# EAGLE design sound sensor (EAGLE 5.10)
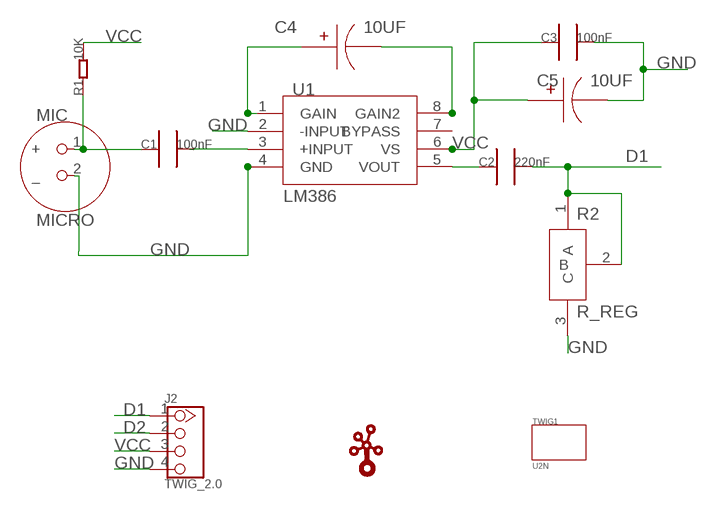
[diagram p0: schematic, sheet 1]

## Parts
C1  100nF  C0603  [0603]
C2  220nF  C0603  [0603]
C3  100nF  C0603  [0603]
C4  10UF  C_TAN1206  [C_TAN1206]
C5  10UF  C_TAN1206  [C_TAN1206]
J2  TWIG_2.0  [2.0_1X4]
MIC  MICRO  [MICRO]
R1  10K  R0603  [0603]
R2  R_REG  [R_REG]
TWIG1  U2N  [U2N]
U1  LM386  [SO08]
U$1  TWIGLOGOTWIGLOGO_SMALL  [TWIGLOGO_SMALL]

## Nets
D1: C2.2 J2.1 R2.1(A) R2.2(B)
D2: J2.2
GND: C3.2 C5.2 J2.4 MIC.2(_) R2.3(C) U1.2(-INPUT) U1.4(GND)
N$2: C4.2 U1.8(GAIN2)
N$3: C1.1 MIC.1(+) R1.1
N$4: C1.2 U1.3(+INPUT)
N$5: C4.1 U1.1(GAIN)
N$6: C2.1 U1.5(VOUT)
VCC: C3.1 C5.1 J2.3 R1.2 U1.6(VS)
Unconnected: U1.7(BYPASS)

## Library data of the parts
C1-C3 = CPT_SMD:C0603; C0603: 100N
C4 C5 = seeedleo:C_TAN1206
J2 = CONNECTER:TWIG_2.0
MIC = seeedleo:MICRO
R1 = CPT_SMD:R0603
R2 = seeedleo:R_REG
TWIG1 = twig_template1:U2N
U1 = seeedleo:LM386
U$1 = seeedleo:TWIGLOGO

## Board
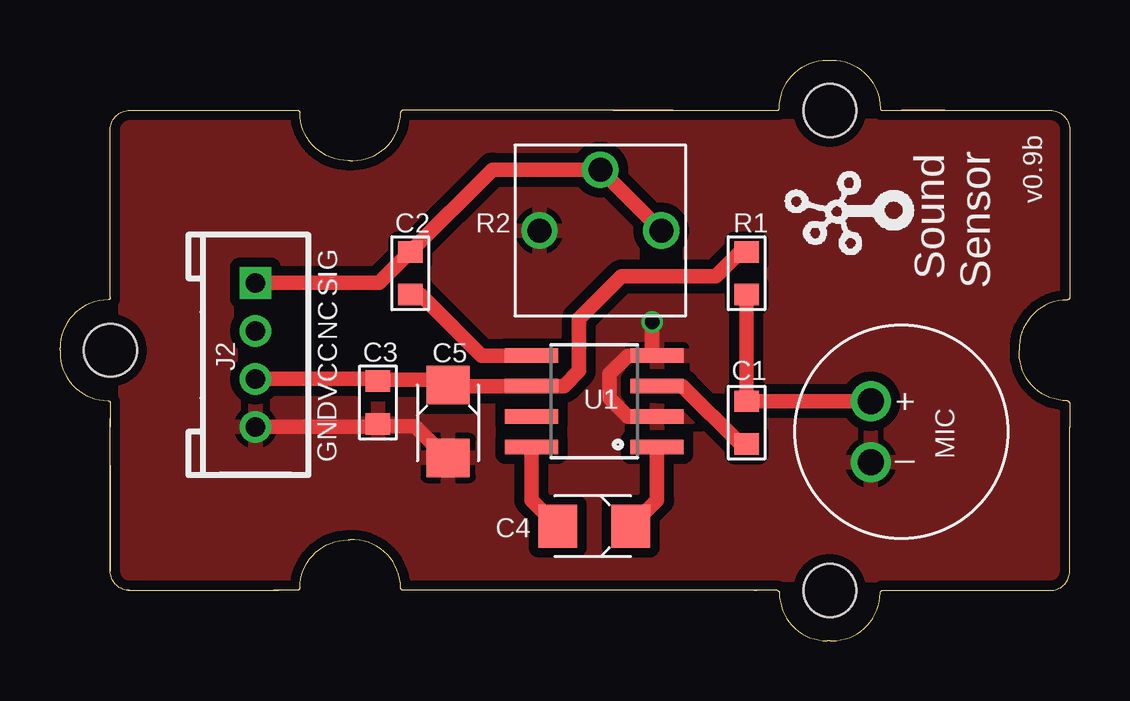
[diagram p1: board, top side]
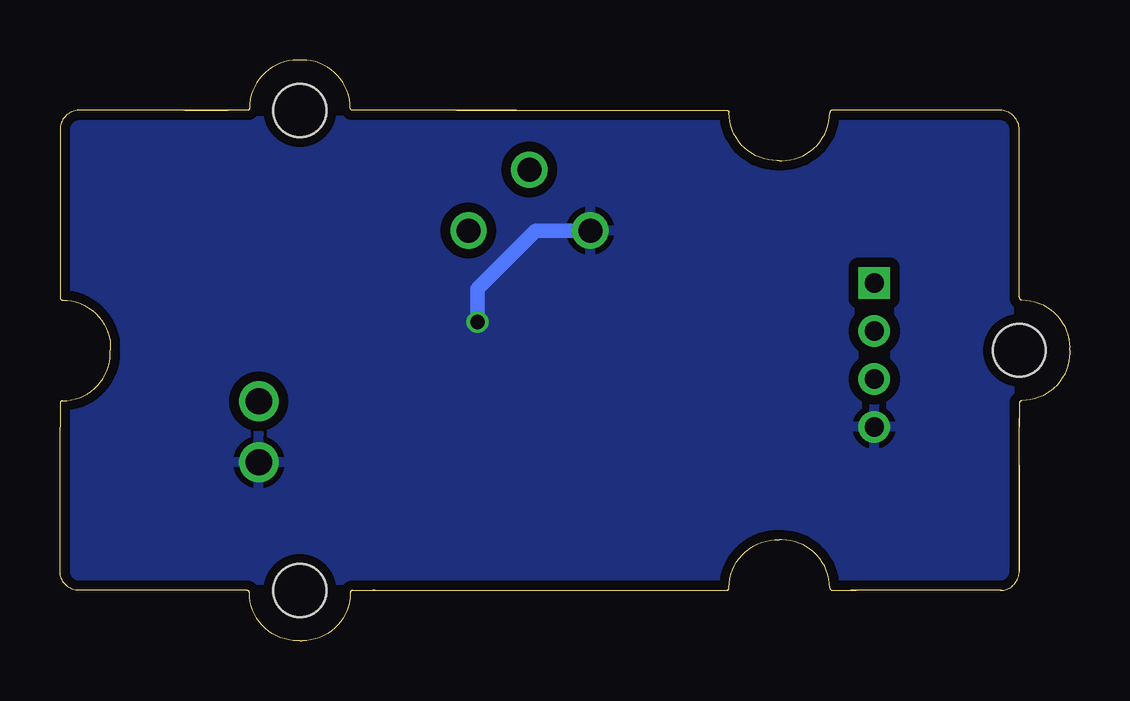
[diagram p2: board, bottom side, seen from below]

Size 42.09 x 24.2 mm. Coordinates in mm from the lower left corner, seen from the top.
Copper layers (1*16): Top 0.035mm / dielectric 1.5mm / Bottom 0.035mm
Design rules "SeeedStudio_rule_no_angle_090911": minimum track width 6mil, minimum drill 12mil, track to track 6mil, track to pad 6mil, pad to pad 6mil, via to via 6mil, smd to smd 0mil, copper to edge 10mil, drill to drill 10mil, minimum pad ring 10mil, minimum via ring 6mil, stop-mask expansion 2mil, vias tented up to drill 100mil, thermal gap 10mil

### Footprints (pad centres in the part's own frame; a part is rotated, then mirrored left to right if it is on the bottom)
0603 = smd 0.889 x 1.016: 1 -0.889,0; 2 0.889,0
C_TAN1206 = smd 1.6 x 1.8: 1 -1.27,0; 2 1.778,0
2.0_1X4 = drill 0.8 pad 1.27 square: 1 -3,0 | drill 0.8 pad 1.27 round: 2 -1,0; 3 1,0; 4 3,0
MICRO = drill 1.1 round: 1 -1.27,1.27; 2 -1.27,-1.27
R_REG = drill 1 round: 1 0,0; 2 2.54,-2.54; 3 5.08,0
U2N = hole 2.2: 10.453,-10.42; 10.453,9.58; -19.535,-0.415
SO08 = smd 0.61 x 2.21: 1 -1.905,-2.616; 2 -0.635,-2.616; 3 0.635,-2.616; 4 1.905,-2.616; 5 1.905,2.616; 6 0.635,2.616; 7 -0.635,2.616; 8 -1.905,2.616

### Placement (x,y rotation side)
C1  28.62,9.09 270 top
C2  14.6,15.31 90 top
C3  13.25,9.93 270 top
C4  22.52,4.77 180 top
C5  16.17,9.4 270 top
J2  8.15,11.91 270 top
MIC  35.07,8.71 0 top
R1  28.62,15.31 90 top
R2  25.06,17.09 180 top
TWIG1  21.64,12.52 0 top
U1  22.27,9.98 90 top
U$1  35.73,15.7 90 top

### Tracks (layer width: path | path; a pad name or v marks a point on that pad's centre or on a via)
D1
  Top 0.61: R2.1 R2.2 18.03,19.63 C2.2 13.31,14.91 J2.1
GND  (via drill 0.6)
  Top 0.61: J2.4 12.74,8.91 C3.2 12.97,8.94 14.8,8.94 16.12,7.62 C5.2 | 24.68,11.88 U1.4 | U1.2 23.67,9.34 22.91,10.11 22.91,11.12 23.67,11.88 24.68,11.88 | 24.68,11.88 v24.68,13.28
  Bottom 0.61: 24.68,13.41 v24.68,13.28 24.68,14.68 22.27,17.09 R2.3
  pour Top (isolate 0.406): -0.59,25.52 45.05,25.52 45.05,-1.83 -0.59,-1.83
  pour Bottom (isolate 0.406): -0.59,25.6 45.13,25.6 45.13,-1.96 -0.59,-1.96
N$2
  Top 0.61: U1.8 19.65,5.86 C4.2
N$3
  Top 0.61: R1.1 C1.1 MIC.1
N$4
  Top 0.61: U1.3 25.95,10.62 28.37,8.2 C1.2
N$5
  Top 0.61: U1.1 24.89,5.86 C4.1
N$6
  Top 0.61: C2.1 15.03,14.42 17.57,11.88 U1.5
VCC
  Top 0.61: C3.1 12.83,10.91 | J2.3 12.78,10.91 C3.1 | C3.1 12.92,10.87 16.17,10.87 C5.1 16.23,10.62 U1.6 21,10.62 21.64,11.25 21.64,13.41 23.41,15.19 27.35,15.19 28.37,16.2 R1.2 28.75,16.2

### Text on the board
tPlace: v0.9b | SIG | Sound | Sensor | NC | VCC | GND